# EAGLE design GoPro-Pilot (EAGLE 8.3.2)
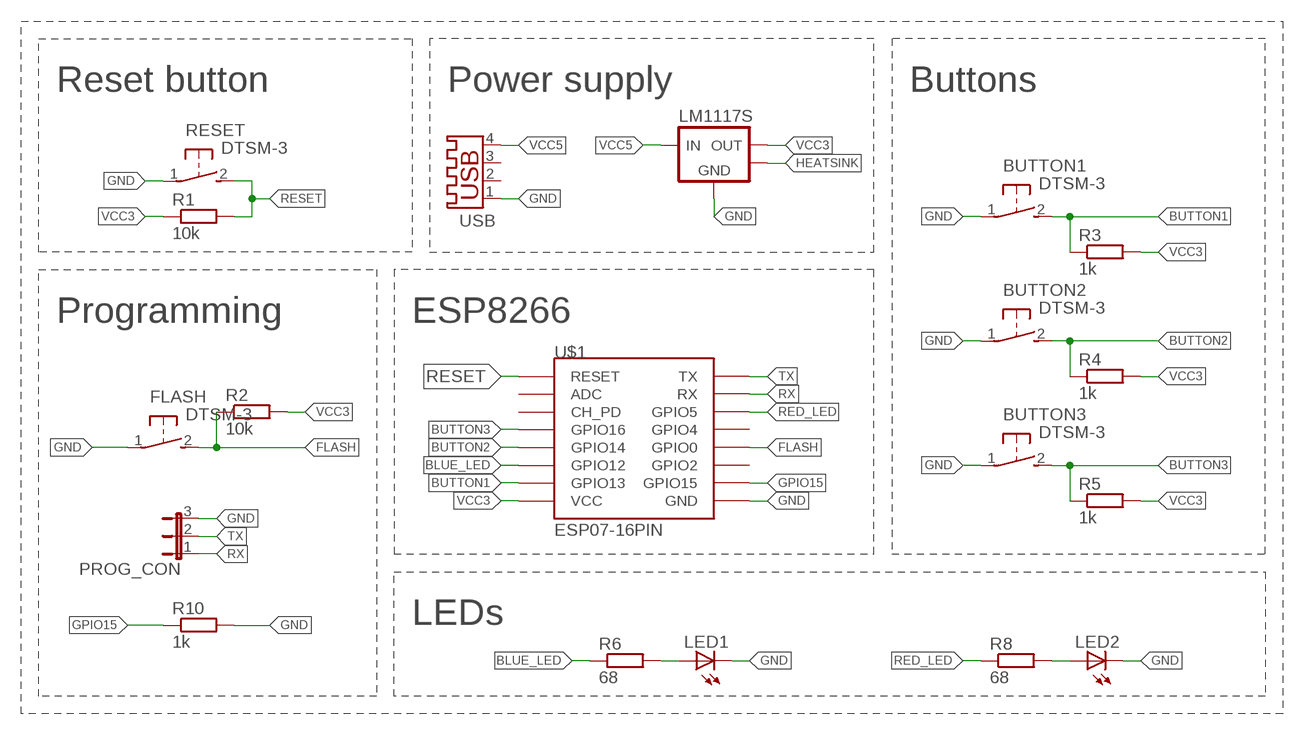
[diagram p0: schematic, sheet 1]

## Parts
BUTTON1  DTSM-3  [DTSM-3]
BUTTON2  DTSM-3  [DTSM-3]
BUTTON3  DTSM-3  [DTSM-3]
FLASH  DTSM-3  [DTSM-3]
LED1  LEDSML0805  [SML0805]
LED2  LEDSML0805  [SML0805]
LM1117S  LM1117-SOT223  [SOT-223-3]
PROG_CON  JP2E  [JP2]
R1  10k  RR1005  [R1005]
R2  10k  RR1005  [R1005]
R3  1k  RR1005  [R1005]
R4  1k  RR1005  [R1005]
R5  1k  RR1005  [R1005]
R6  68  RR1005  [R1005]
R8  68  RR1005  [R1005]
R10  1k  RR1005  [R1005]
RESET  DTSM-3  [DTSM-3]
U$1  ESP07-16PIN  [ESP07-16PIN]
USB  USB-A003  [USB-A003]

## Nets
BLUE_LED: R6.1 U$1.GPIO12
BUTTON1: BUTTON1.2 R3.1 U$1.GPIO13
BUTTON2: BUTTON2.2 R4.1 U$1.GPIO14
BUTTON3: BUTTON3.2 R5.1 U$1.GPIO16
FLASH: FLASH.2 R2.1 U$1.GPIO0
GND: BUTTON1.1 BUTTON2.1 BUTTON3.1 FLASH.1 LED1.C LED2.C LM1117S.1(GND) PROG_CON.3 R10.2 RESET.1 U$1.GND USB.1
GPIO15: R10.1 U$1.GPIO15
HEATSINK: LM1117S.4(HEATSINK)
N$2: LED2.A R8.2
N$4: LED1.A R6.2
RED_LED: R8.1 U$1.GPIO4(GPIO5)
RESET: R1.2 RESET.2 U$1.REST(RESET)
RX: PROG_CON.1 U$1.RX
TX: PROG_CON.2 U$1.TX
VCC3: LM1117S.2(VOUT) R1.1 R2.2 R3.2 R4.2 R5.2 U$1.VCC
VCC5: LM1117S.3(VIN) USB.4
Unconnected: U$1.ADC U$1.CH_PD U$1.GPIO2 U$1.GPIO5(GPIO4) USB.2 USB.3

## Notes on the sheet
- Reset button | Power supply | Buttons
- Programming | ESP8266
- LEDs

## Library data of the parts
BUTTON1-BUTTON3 FLASH RESET = switch-tact:DTSM-3
LED1 LED2 = led:LED: LED OSRAM: - CHIPLED LG R971, LG N971, LY N971, LG Q971, LY Q971, LO R971, LY R971 LH N974, LH R974 LS Q976, LO Q976, LY Q976 LO Q996 - Hyper CHIPLED LW Q18S LB Q993, LB Q99A, LB R99A - SideLED LS A670, LO A670, LY A670, LG A670, LP A670 LB A673, LV A673, LT A673, LW A673 LH A674 LY A675 LS A676, LA A676, LO A676, LY A676, LW A676 LS A679, LY A679, LG A679 - Hyper Micro SIDELED® LS Y876, LA Y876, LO Y876, LY Y876 LT Y87S - SmartLED LW L88C, LW L88S LB L89C, LB L89S, LG L890 LS L89K, LO L89K, LY L89K LS L896, LA L896, LO L896, LY L896 - TOPLED LS T670, LO T670, LY T670, LG T670, LP T670 LSG T670, LSP T670, LSY T670, LOP T670, LYG T670 LG T671, LOG T671, LSG T671 LB T673, LV T673, LT T673, LW T673 LH T674 LS T676, LA T676, LO T676, LY T676, LB T676, LH T676, LSB T676, LW T676 LB T67C, LV T67C, LT T67C, LS T67K, LO T67K, LY T67K, LW E67C LS E67B, LA E67B, LO E67B, LY E67B, LB E67C, LV E67C, LT E67C LW T67C LS T679, LY T679, LG T679 LS T770, LO T770, LY T770, LG T770, LP T770 LB T773, LV T773, LT T773, LW T773 LH T774 LS E675, LA E675, LY E675, LS T675 LS T776, LA T776, LO T776, LY T776, LB T776 LHGB T686 LT T68C, LB T68C - Hyper Mini TOPLED® LB M676 - Mini TOPLED Santana® LG M470 LS M47K, LO M47K, LY M47K Source: http://www.osram.convergy.de LUXEON: - LUMILED® LXK2-PW12-R00, LXK2-PW12-S00, LXK2-PW14-U00, LXK2-PW14-V00 LXK2-PM12-R00, LXK2-PM12-S00, LXK2-PM14-U00 LXK2-PE12-Q00, LXK2-PE12-R00, LXK2-PE12-S00, LXK2-PE14-T00, LXK2-PE14-U00 LXK2-PB12-K00, LXK2-PB12-L00, LXK2-PB12-M00, LXK2-PB14-N00, LXK2-PB14-P00, LXK2-PB14-Q00 LXK2-PR12-L00, LXK2-PR12-M00, LXK2-PR14-Q00, LXK2-PR14-R00 LXK2-PD12-Q00, LXK2-PD12-R00, LXK2-PD12-S00 LXK2-PH12-R00, LXK2-PH12-S00 LXK2-PL12-P00, LXK2-PL12-Q00, LXK2-PL12-R00 Source: www.luxeon.com KINGBRIGHT: KA-3528ASYC Source: www.kingbright.com
LM1117S = bt_regulator:LM1117: LDO Voltage Regulator NCP1117 Output Current in Excess of 1.0 A 1.2 V Maximum Dropout Voltage at 800 mA Over Temperature Fixed Output Voltages of 1.5, 1.8, 1.9, 2.0, 2.5, 2.85, 3.3, 5.0, and 12 V Adjustable Output Voltage Option No Minimum Load Requirement for Fixed Voltage Output Devices Reference/Output Voltage Trimmed to ±1.0% Current Limit, Safe Operating and Thermal Shutdown Protection Operation to 20 V Input NCV Prefix for Automotive and Other Applications Requiring Unique Site and Control Change Requirements; AEC−Q100 Qualified and PPAP Capable datasheet.pdf <http://www.onsemi.com/pub/Collateral/NCP1117-D.PDF> LM1117 Available in 1.8 V, 2.5 V, 3.3 V, 5 V, and adjustable versions Output Current 800 mA Current Limiting and Thermal Protection Space-Saving SOT-223 and WSON Packages Line Regulation 0.2% (Maximum) Load Regulation 0.4% (Maximum) Temperature: LM1117: 0°C to 125°C; LM1117I: −40°C to 125°C LM1117 (Rev. N) is a series of low dropout voltage regulators of 1.2V at 800mA of load current. It has the same pin-out as Texas Instruments' industry standard LM317. The LM1117-N is available in an adjustable version, available in five fixed voltages, 1.8V, 2.5V, 2.85V, 3.3V, and 5V. The LM1117-N offers current limiting and thermal shutdown. Its circuit includes a zener trimmed to within ±1%. datasheet.pdf <http://www.ti.com/lit/ds/symlink/lm1117.pdf>
PROG_CON = jumper:JP2E: JUMPER
R1-R6 R8 R10 = eagle-ltspice:R: RESISTOR, European symbol; SPICEMODEL: NONE; SPICEPREFIX: R
U$1 = esp8266modules:ESP07-16PIN: ESP8266 Wifi module 07 - 16 pins; DIMENSIONS: 22.0 x 16.0 mm; PINS: 16; PITCH: 0.078" / 2 mm
USB = con-yamaichi:USB-A003: USB connector; OC_FARNELL: unknown; OC_NEWARK: unknown

## Board
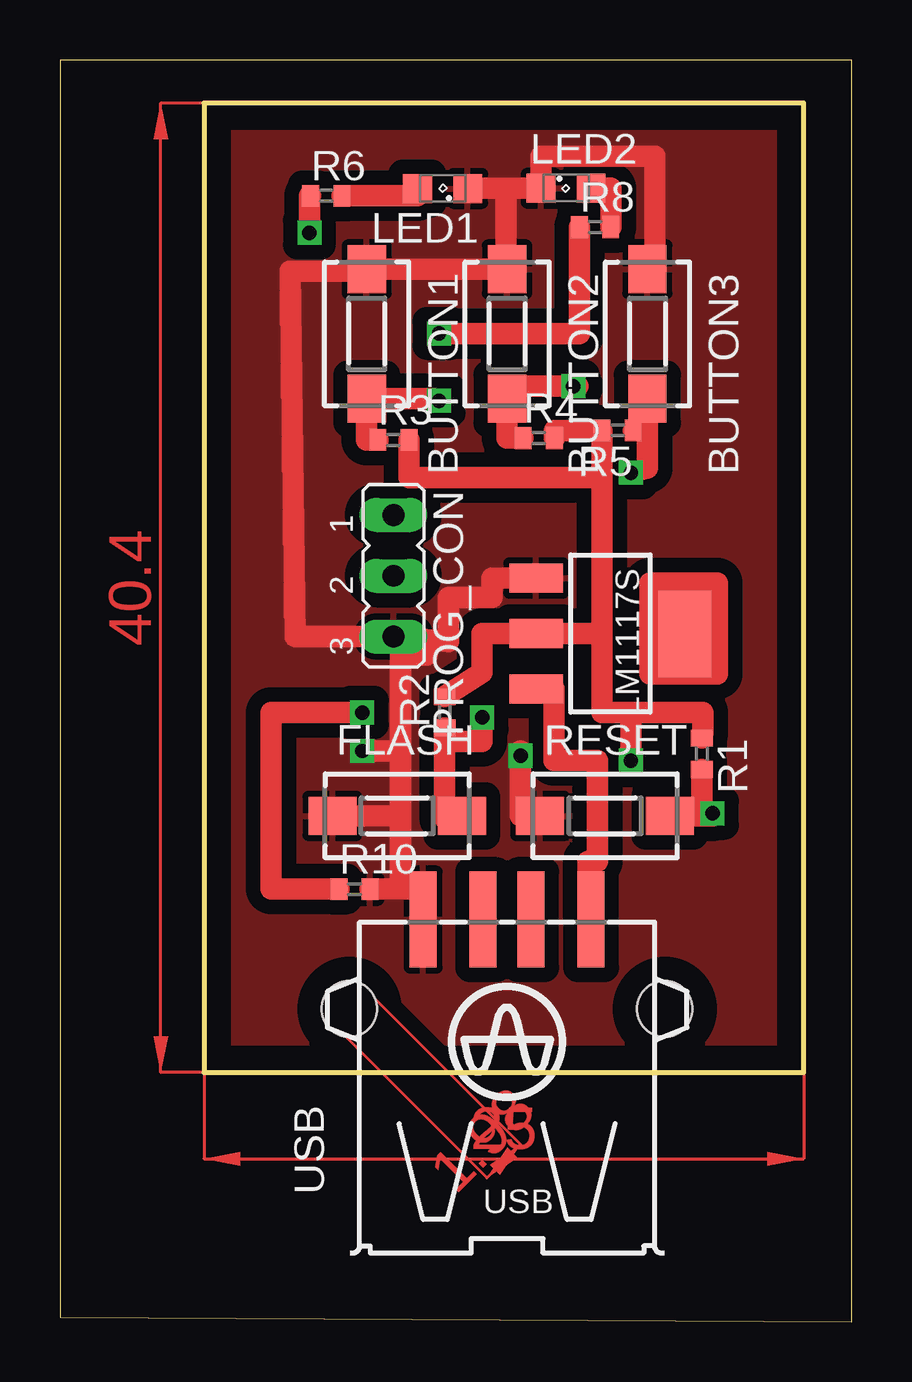
[diagram p1: board, top side]
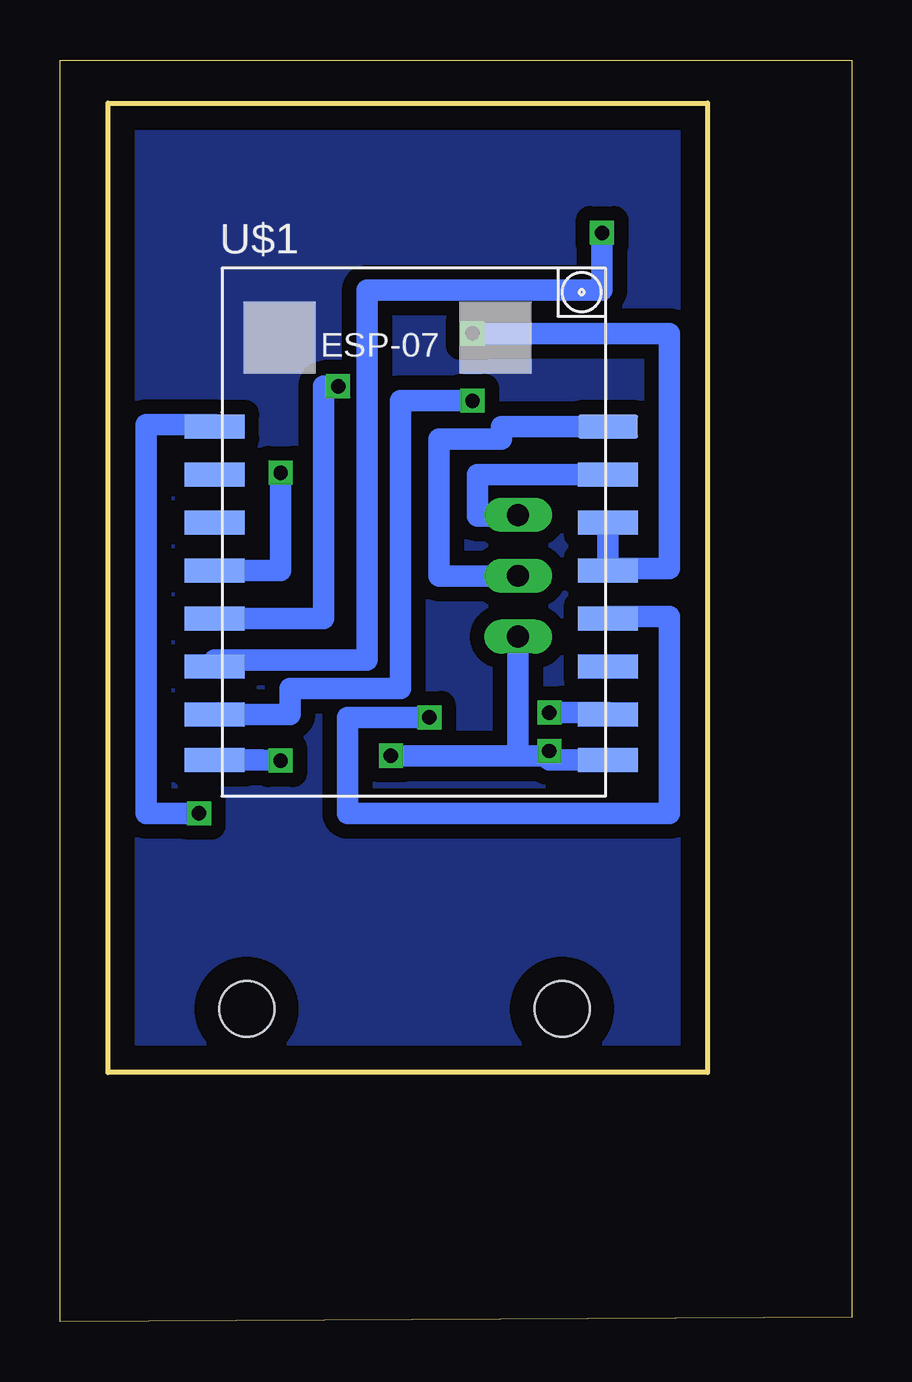
[diagram p2: board, bottom side, seen from below]

Size 33 x 52.6 mm. Coordinates in mm from the lower left corner, seen from the top.
Outline: 0,0.2 33,0 33,52.6 0,52.6 0,0.2
Outline: 6,10.4 31,10.4 31,50.8 6,50.8 6,10.4
Copper layers (1*16): Top 0.035mm / dielectric 1.5mm / Bottom 0.035mm
Design rules "default": minimum track width 6mil, minimum drill 0.35mm, track to track 6mil, track to pad 6mil, pad to pad 6mil, via to via 6mil, smd to smd 6mil, copper to edge 40mil, drill to drill 6mil, minimum pad ring 10mil, minimum via ring 8mil, stop-mask expansion 4mil, vias tented up to drill 0mil, thermal gap 10mil

### Footprints (pad centres in the part's own frame; a part is rotated, then mirrored left to right if it is on the bottom)
DTSM-3 = smd 2 x 1.6: 1 -2.7,0; 2 2.7,0
SML0805 = smd 1.2 x 1.2: A 1.05,0; C -1.05,0
SOT-223-3 = smd 1.219 x 2.235: 1 -2.311,-3.099; 2 0,-3.099; 3 2.311,-3.099 | smd 3.6 x 2.2: 4 0,3.099
JP2 = drill 0.914 long: 1 -2.54,0; 2 0,0; 3 2.54,0
R1005 = smd 0.7 x 0.9: 1 -0.65,0; 2 0.65,0
ESP07-16PIN = smd 2.5 x 1: ADC -8.2,3.8; CH_PD -8.2,1.8; GND 8.2,-8.105; GPIO0 8.2,-2.2; GPIO2 8.2,-4.2; GPIO4 8.2,1.8; GPIO5 8.2,-0.2; GPIO12 -8.2,-4.2; GPIO13 -8.2,-6.2; GPIO14 -8.2,-2.2; GPIO15 8.2,-6.2; GPIO16 -8.2,-0.2; REST -8.2,5.8; RX 8.2,3.8; TX 8.2,5.8; VCC -8.2,-8.105
USB-A003 = smd 1.12 x 4: 1 -3.5,14; 2 -1,14; 3 1,14; 4 3.5,14 | hole 2.3: -6.57,10.28; 6.57,10.28

### Placement (x,y rotation side)
BUTTON1  12.79,41.18 270 top
BUTTON2  18.64,41.18 270 top
BUTTON3  24.49,41.18 270 top
FLASH  14.06,21.09 0 top
LED1  15.95,47.24 180 top
LED2  21.1,47.26 0 top
LM1117S  22.95,28.69 270 top
PROG_CON  13.9,31.1 270 top
R1  26.76,23.68 270 top
R2  16.04,25.41 90 top
R3  13.9,36.76 0 top
R4  19.96,36.84 0 top
R5  23.25,37.16 180 top
R6  11.1,46.94 0 top
R8  22.31,45.63 0 top
R10  12.28,18.04 0 top
RESET  22.72,21.09 0 top
U$1  18.35,31.52 0 bottom
USB  18.64,2.77 0 top

### Tracks (layer width: path | path; a pad name or v marks a point on that pad's centre or on a via)
BLUE_LED  (via drill 0.6)
  Top 0.9: R6.1 10.4,46.94 v10.4,45.4
  Bottom 0.9: v10.4,45.4 10.4,43 20.2,43 20.2,27.6 26.55,27.6 U$1.GPIO12
BUTTON1  (via drill 0.6)
  Top 0.9: R3.1 12.79,36.76 BUTTON1.2 15.6,38.48 15.6,38.4 v15.8,38.4
  Bottom 0.9: v15.8,38.4 18.8,38.4 18.8,26.4 23.4,26.4 23.4,25.32 U$1.GPIO13
BUTTON2  (via drill 0.6)
  Top 0.9: R4.1 18.64,36.84 BUTTON2.2 18.64,39 v21.4,39 21.6,39
  Bottom 0.9: v21.4,39 22,39 22,29.32 U$1.GPIO14
BUTTON3  (via drill 0.6)
  Top 0.9: BUTTON3.2 24.49,37.16 | R5.1 24.49,37.16 | 24.49,37.16 24.49,35.6 v23.8,35.4
  Bottom 0.9: v23.8,35.4 23.8,31.32 U$1.GPIO16
FLASH  (via drill 0.6)
  Top 0.9: 16.56,21.09 FLASH.2 | FLASH.2 16.64,21.09 | FLASH.2 17.2,21.09 17.2,21 16.04,21 16.04,24.2 | 16.04,24.2 17.6,24.2 v17.6,25.2 | R2.1 16.04,24.2
  Bottom 0.9: U$1.GPIO0 10.15,29.4 7.6,29.4 7.6,21.2 21,21.2 21,25.2 v17.6,25.2
GND  (via drill 0.6)
  Top 0.9: LED1.C 17,47.26 18.6,47.26 | 18.6,47.26 LED2.C 20.05,48.6 24.8,48.6 24.8,44.4 24.49,44.4 BUTTON3.1 | 18.6,43.88 18.6,47.26 | 18.6,43.88 BUTTON2.1 | 18.6,43.88 BUTTON1.1 12.79,43.8 9.6,43.8 9.8,28.56 PROG_CON.3 | 20,21.09 RESET.1 19.2,21.09 v19.2,23.6 19.2,23.8 | FLASH.1 14.2,21.09 | 14.2,23.8 14.2,21.09 | 14.2,23.8 14.2,27.8 15.3,27.8 PROG_CON.3 | PROG_CON.3 16.2,28.36 16.2,30.2 18,30.2 18,31 LM1117S.1 | v12.6,23.8 14.2,23.8 | 14.2,21.09 14.2,18.04 | 14.2,18.04 R10.2 | 14.2,18.04 15.14,18.04 USB.1
  Bottom 0.9: U$1.GND 12.6,23.41 12.6,23.6 | 12.6,23.6 v12.6,23.8 | v19.2,23.6 13.9,23.6 | 13.9,23.6 PROG_CON.3 | 13.9,23.6 12.6,23.6
  pour Top (isolate 0.6): 6,10.4 31,10.4 31,50.8 6,50.8
GPIO15  (via drill 0.6)
  Top 0.9: R10.1 8.8,18.04 8.8,25.4 v12.6,25.4
  Bottom 0.9: v12.6,25.4 10.15,25.4 U$1.GPIO15
HEATSINK
  Top 0.9: 24.6,28.69 LM1117S.4 | 24.6,28.69 24.6,29.4 24.6,30.8 | 24.6,28.69 24.6,27 27.4,27 27.4,30.8 24.8,30.8 24.8,28.69 24.6,28.69
N$1
  pour Bottom (isolate 0.6): 6,50.8 6,10.4 31,10.4 31,50.8
N$2
  Top 0.9: LED2.A 22.96,47.26 R8.2
N$4
  Top 0.9: LED1.A 14.9,46.94 R6.2
RED_LED  (via drill 0.6)
  Top 0.9: R8.1 21.66,41.2 v15.8,41.2
  Bottom 0.9: v15.8,41.2 7.6,41.2 7.6,31.4 10.15,31.4 U$1.GPIO4
RESET  (via drill 0.6)
  Top 0.9: RESET.2 27.2,21.09 v27.2,21.2 26.76,21.2 R1.2
  Bottom 0.9: U$1.REST 26.55,37.4 29.4,37.4 29.4,21.2 v27.2,21.2
RX
  Bottom 0.9: U$1.RX 15.6,35.32 15.6,33.6 13.9,33.6 PROG_CON.1
TX
  Bottom 0.9: U$1.TX 14.6,37.32 14.6,36.8 17.2,36.8 17.2,31.1 PROG_CON.2
VCC3  (via drill 0.6)
  Top 0.9: 22.6,28.69 LM1117S.2 17.6,28.69 17.6,27.06 R2.2 | 22.6,35.2 22.6,28.69 | 22.6,35.2 R5.2 20.61,37.16 R4.2 | R3.2 14.55,35.2 22.6,35.2 | 22.6,28.69 22.6,25.4 23.8,25.4 | 23.8,25.4 26.8,25.4 26.8,24.53 R1.1 | 23.8,25.4 v23.8,23.4
  Bottom 0.9: v23.8,23.4 24.6,23.41 U$1.VCC
VCC5
  Top 0.9: USB.4 22,16.77 22,19.2 22.4,19.2 22.4,23.4 20.6,23.4 20.6,26.4 19.85,26.4 LM1117S.3
(copper drawn outside any net)
  shapes: Top area x3